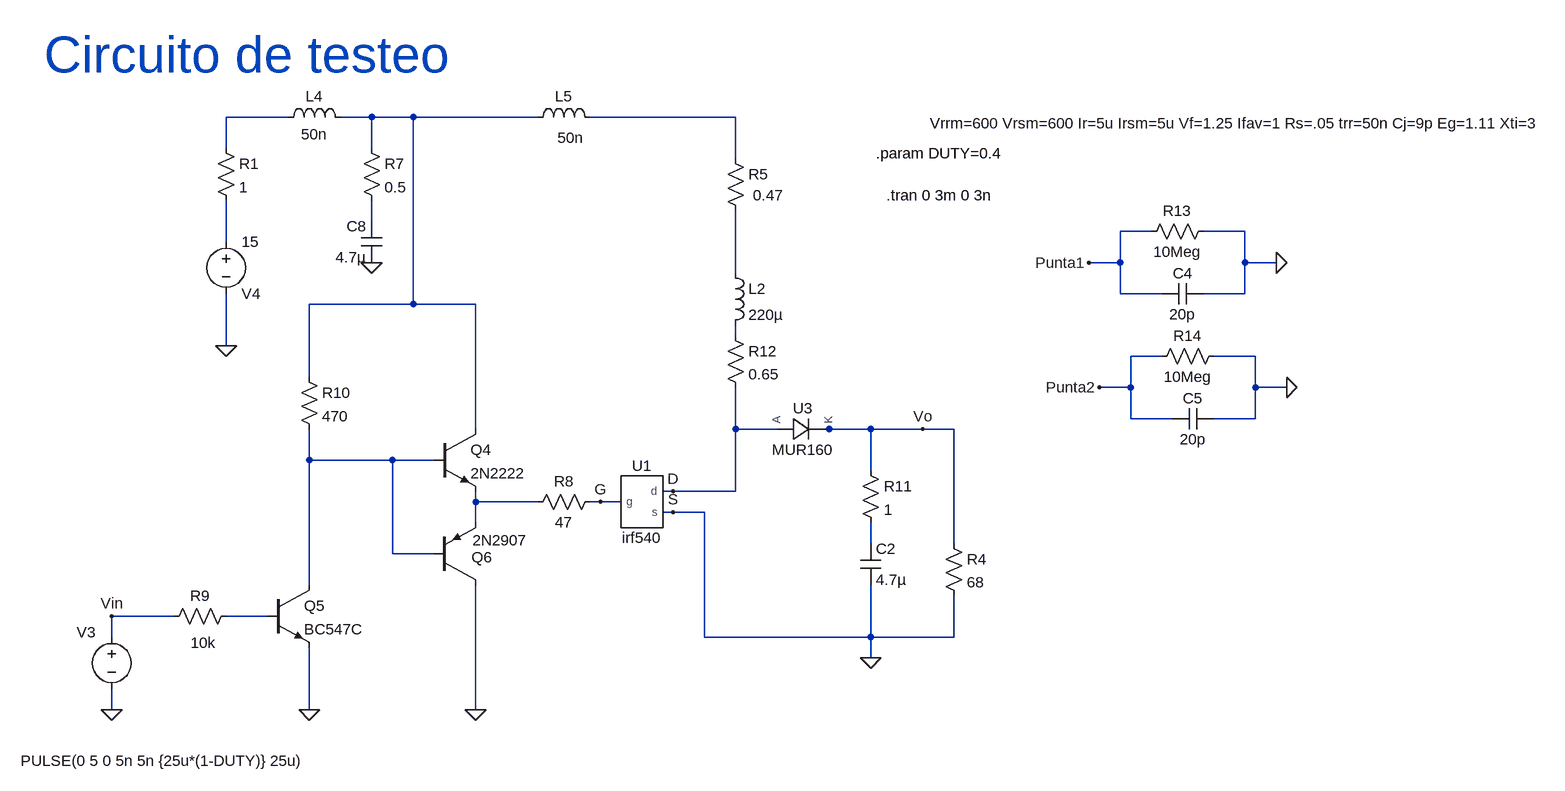
[diagram p0: schematic TestSch.asc]
TestSch.asc, the LTspice schematic file:
Version 4
SHEET 1 4548 1984
WIRE 1616 -320 1520 -320
WIRE 1744 -320 1696 -320
WIRE 1808 -320 1744 -320
WIRE 2000 -320 1808 -320
WIRE 2304 -320 2080 -320
WIRE 1520 -272 1520 -320
WIRE 1744 -272 1744 -320
WIRE 2304 -256 2304 -320
WIRE 1744 -160 1744 -192
WIRE 2944 -144 2896 -144
WIRE 3088 -144 3024 -144
WIRE 1520 -128 1520 -192
WIRE 2896 -96 2896 -144
WIRE 2896 -96 2848 -96
WIRE 3088 -96 3088 -144
WIRE 3136 -96 3088 -96
WIRE 2304 -80 2304 -176
WIRE 2896 -48 2896 -96
WIRE 2960 -48 2896 -48
WIRE 3088 -48 3088 -96
WIRE 3088 -48 3024 -48
WIRE 1808 -32 1808 -320
WIRE 1808 -32 1648 -32
WIRE 1904 -32 1808 -32
WIRE 2304 16 2304 0
WIRE 1520 32 1520 -48
WIRE 2960 48 2912 48
WIRE 3104 48 3040 48
WIRE 1648 80 1648 -32
WIRE 2912 96 2912 48
WIRE 2912 96 2864 96
WIRE 3104 96 3104 48
WIRE 3152 96 3104 96
WIRE 2912 144 2912 96
WIRE 2976 144 2912 144
WIRE 3104 144 3104 96
WIRE 3104 144 3040 144
WIRE 1904 160 1904 -32
WIRE 2304 160 2304 96
WIRE 2368 160 2304 160
WIRE 2448 160 2432 160
WIRE 2512 160 2448 160
WIRE 2592 160 2512 160
WIRE 2640 160 2592 160
WIRE 1648 208 1648 160
WIRE 1776 208 1648 208
WIRE 1840 208 1776 208
WIRE 2512 224 2512 160
WIRE 2208 256 2192 256
WIRE 2304 256 2304 160
WIRE 2304 256 2208 256
WIRE 1904 272 1904 256
WIRE 2000 272 1904 272
WIRE 2096 272 2080 272
WIRE 2128 272 2096 272
WIRE 2208 288 2192 288
WIRE 2256 288 2208 288
WIRE 1904 304 1904 272
WIRE 2512 336 2512 304
WIRE 2640 336 2640 160
WIRE 1776 352 1776 208
WIRE 1840 352 1776 352
WIRE 1648 400 1648 208
WIRE 1440 448 1344 448
WIRE 1584 448 1520 448
WIRE 1344 480 1344 448
WIRE 2256 480 2256 288
WIRE 2512 480 2512 400
WIRE 2512 480 2256 480
WIRE 2640 480 2640 416
WIRE 2640 480 2512 480
WIRE 2512 512 2512 480
WIRE 1344 592 1344 560
WIRE 1648 592 1648 496
WIRE 1904 592 1904 400
FLAG 1344 592 0
FLAG 1520 32 0
FLAG 2512 512 0
FLAG 1648 592 0
FLAG 1904 592 0
FLAG 2848 -96 Punta1
FLAG 3136 -96 0
FLAG 2864 96 Punta2
FLAG 3152 96 0
FLAG 2592 160 Vo
FLAG 2096 272 G
FLAG 2208 256 D
FLAG 2208 288 S
FLAG 1744 -96 0
FLAG 1344 448 Vin
SYMBOL cap 2496 336 R0
SYMATTR InstName C2
SYMATTR Value 4.7µ
SYMBOL res 2624 320 R0
SYMATTR InstName R4
SYMATTR Value 68
SYMBOL res 2288 -272 R0
WINDOW 3 43 72 Left 2
SYMATTR Value 0.47
SYMATTR InstName R5
SYMBOL ind 2288 -96 R0
SYMATTR InstName L2
SYMATTR Value 220µ
SYMBOL voltage 1344 464 R0
WINDOW 0 -54 9 Left 2
WINDOW 3 -140 206 Left 2
WINDOW 123 0 0 Left 0
WINDOW 39 0 0 Left 0
SYMATTR InstName V3
SYMATTR Value PULSE(0 5 0 5n 5n {25u*(1-DUTY)} 25u)
SYMBOL voltage 1520 -144 R0
WINDOW 0 24 96 Left 2
WINDOW 3 24 16 Left 2
WINDOW 123 0 0 Left 0
WINDOW 39 0 0 Left 0
SYMATTR InstName V4
SYMATTR Value 15
SYMBOL res 2096 256 R90
WINDOW 0 0 56 VBottom 2
WINDOW 3 32 56 VTop 2
SYMATTR InstName R8
SYMATTR Value 47
SYMBOL npn 1840 160 R0
SYMATTR InstName Q4
SYMATTR Value 2N2222
SYMBOL npn 1584 400 R0
SYMATTR InstName Q5
SYMATTR Value BC547C
SYMBOL res 1536 432 R90
WINDOW 0 0 56 VBottom 2
WINDOW 3 41 51 VTop 2
SYMATTR InstName R9
SYMATTR Value 10k
SYMBOL res 1632 64 R0
SYMATTR InstName R10
SYMATTR Value 470
SYMBOL pnp 1840 400 M180
WINDOW 0 58 43 Left 2
WINDOW 3 59 69 Left 2
SYMATTR InstName Q6
SYMATTR Value 2N2907
SYMBOL irf540_V2 2160 272 R0
SYMATTR InstName U1
SYMBOL mur160 2400 160 R90
WINDOW 0 -16 -8 VBottom 2
WINDOW 3 16 -8 VTop 2
WINDOW 39 -486 -676 VTop 2
SYMATTR InstName U3
SYMBOL res 2496 208 R0
SYMATTR InstName R11
SYMATTR Value 1
SYMBOL res 2288 0 R0
SYMATTR InstName R12
SYMATTR Value 0.65
SYMBOL res 3040 -160 R90
WINDOW 0 0 56 VBottom 2
WINDOW 3 32 56 VTop 2
SYMATTR InstName R13
SYMATTR Value 10Meg
SYMBOL cap 3024 -64 R90
WINDOW 0 0 32 VBottom 2
WINDOW 3 32 32 VTop 2
SYMATTR InstName C4
SYMATTR Value 20p
SYMBOL res 3056 32 R90
WINDOW 0 0 56 VBottom 2
WINDOW 3 32 56 VTop 2
SYMATTR InstName R14
SYMATTR Value 10Meg
SYMBOL cap 3040 128 R90
WINDOW 0 0 32 VBottom 2
WINDOW 3 32 32 VTop 2
SYMATTR InstName C5
SYMATTR Value 20p
SYMBOL res 1504 -288 R0
SYMATTR InstName R1
SYMATTR Value 1
SYMBOL ind 1600 -304 R270
WINDOW 0 32 56 VTop 2
WINDOW 3 5 56 VBottom 2
SYMATTR InstName L4
SYMATTR Value 50n
SYMBOL ind 1984 -304 R270
WINDOW 0 32 56 VTop 2
WINDOW 3 0 66 VBottom 2
SYMATTR InstName L5
SYMATTR Value 50n
SYMBOL cap 1760 -96 R180
WINDOW 0 24 56 Left 2
WINDOW 3 24 8 Left 2
SYMATTR InstName C8
SYMATTR Value 4.7µ
SYMBOL res 1728 -288 R0
SYMATTR InstName R7
SYMATTR Value 0.5
TEXT 2536 -200 Left 2 !.tran 0 3m 0 3n
TEXT 1240 -416 Left 6 ;Circuito de testeo
TEXT 2520 -264 Left 2 !.param DUTY=0.4

The netlist it stands for:
* TestSch.asc
C2 N010 0 4.7µ
R4 Vo 0 68
R5 N003 N006 0.47
L2 N006 N007 220µ
V3 Vin 0 PULSE(0 5 0 5n 5n {25u*(1-DUTY)} 25u)
V4 N005 0 15
R8 G N009 47
Q4 N002 N008 N009 0 2N2222
Q5 N008 N011 0 0 BC547C
R9 N011 Vin 10k
R10 N002 N008 470
Q6 0 N008 N009 0 2N2907
XU1 D G 0 irf540  ; pins d g s
XU3 D Vo MUR160 Vrrm=600 Vrsm=600 Ir=5u Irsm=5u Vf=1.25 Ifav=1 Rs=.05 trr=50n Cj=9p Eg=1.11 Xti=3  ; pins A K
R11 Vo N010 1
R12 N007 D 0.65
R13 0 Punta1 10Meg
C4 0 Punta1 20p
R14 0 Punta2 10Meg
C5 0 Punta2 20p
R1 N001 N005 1
L4 N001 N002 50n
L5 N002 N003 50n
C8 0 N004 4.7µ
R7 N002 N004 0.5
.model NPN NPN
.model PNP PNP
.lib standard.bjt
.tran 0 3m 0 3n
* Circuito de testeo
.param DUTY=0.4
.lib Libraries\sihf540.lib
.lib Libraries\mur160_spice.lib
.backanno
.end